# Altium schematic sheet RST_SER_2.SchDoc
size A3
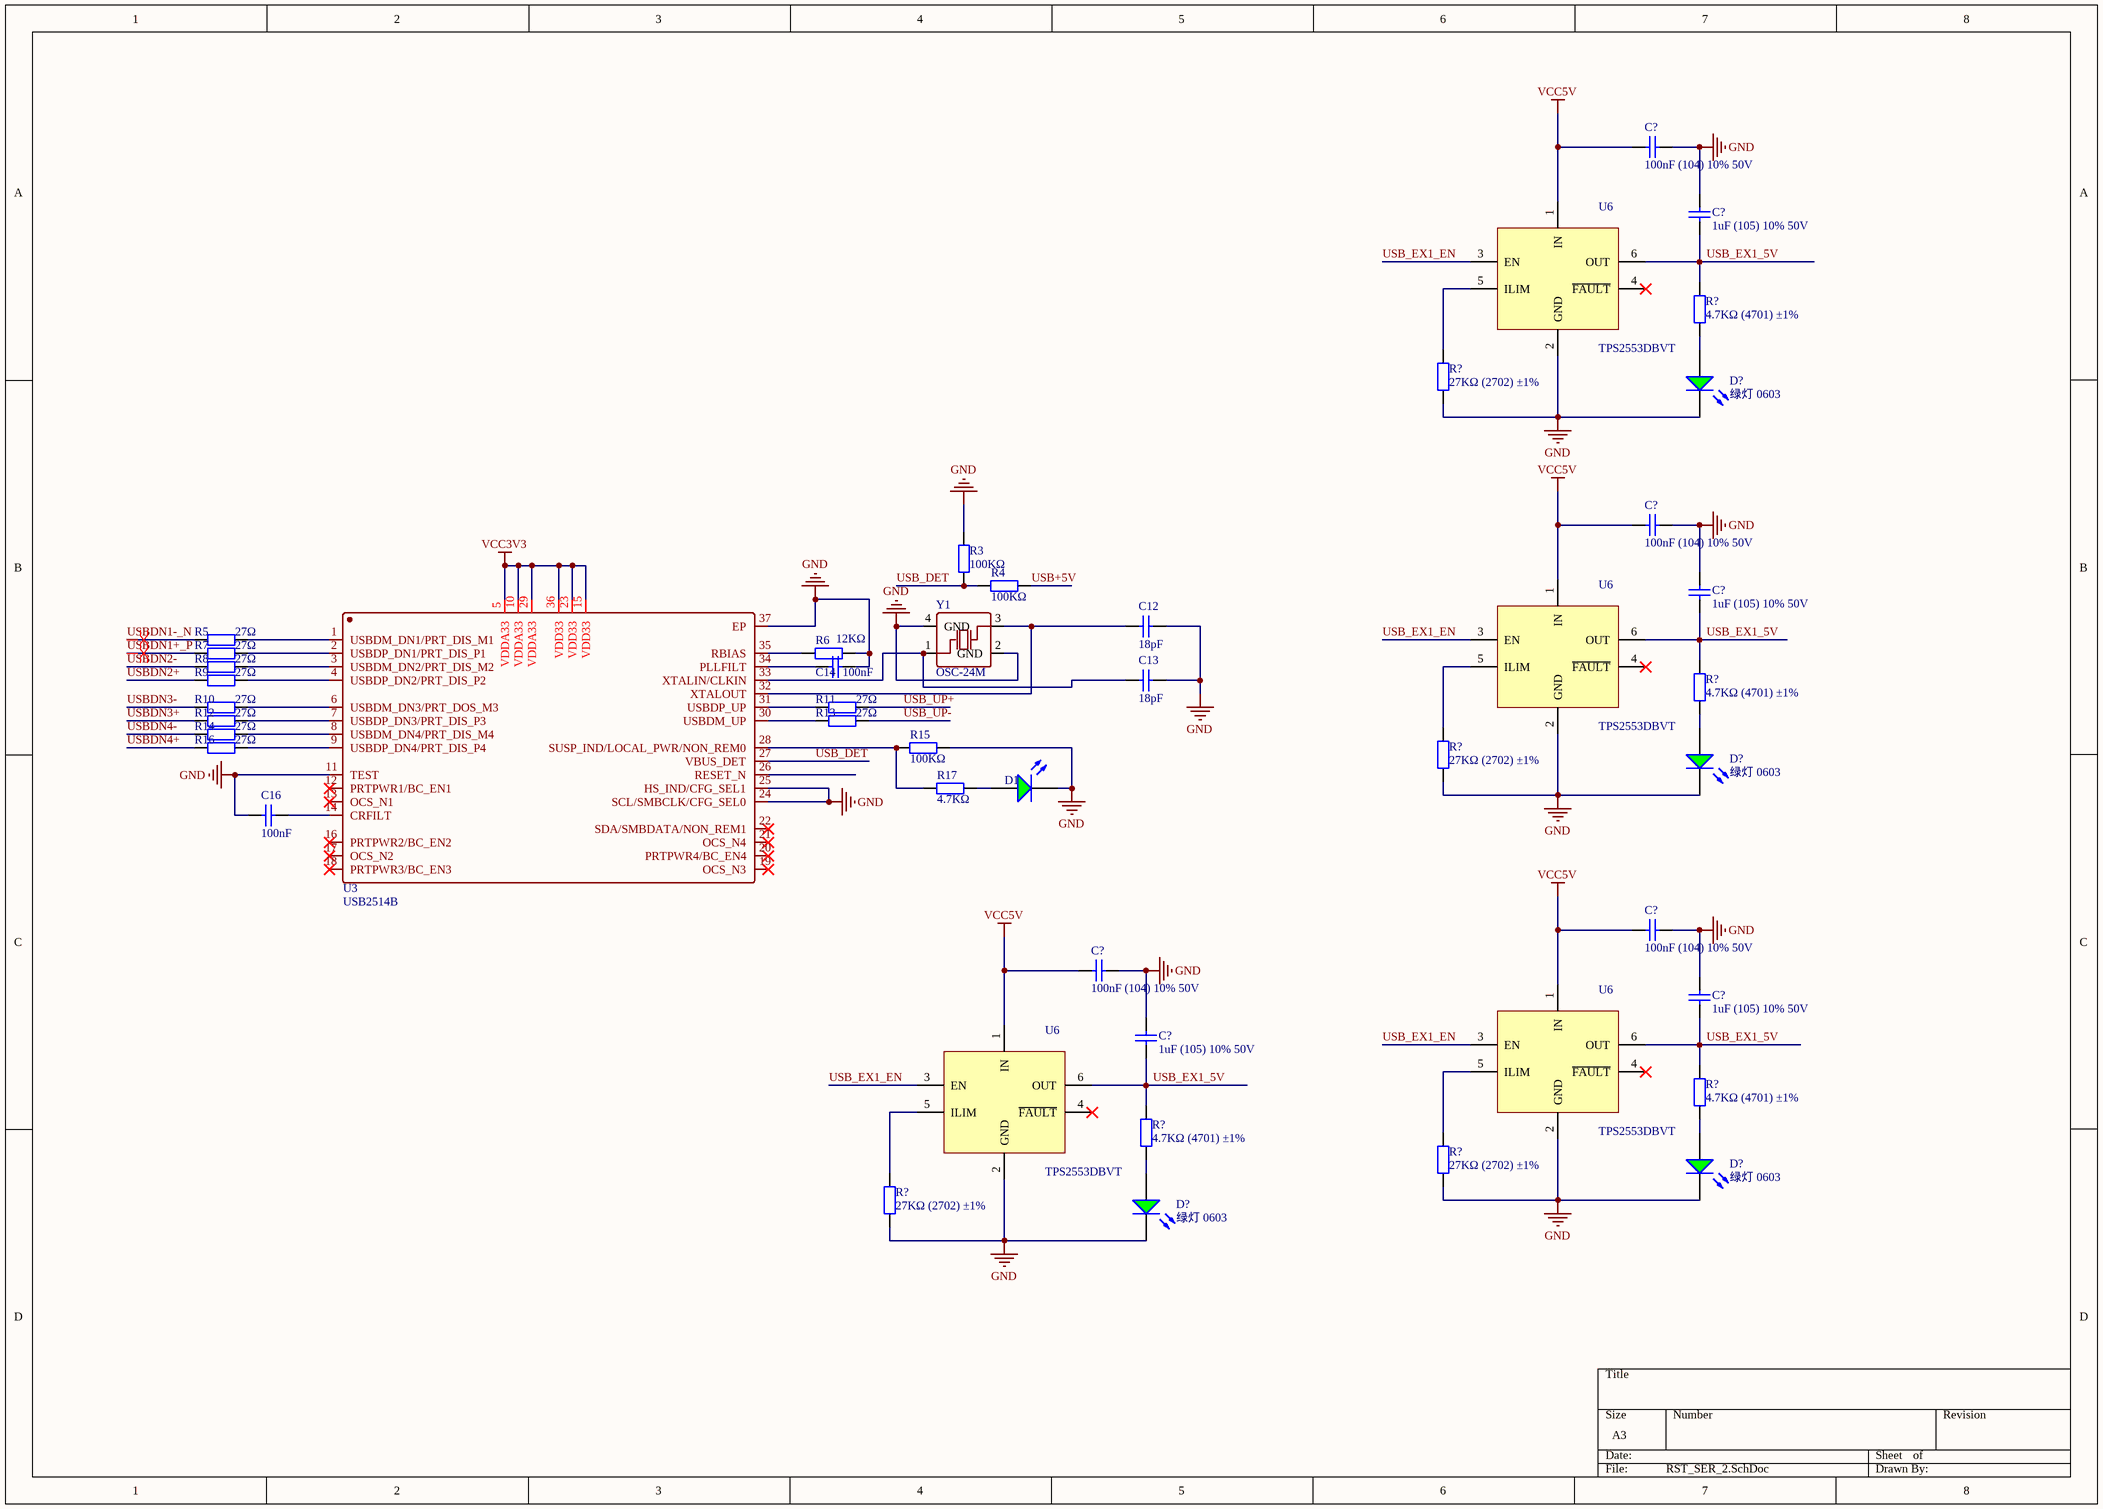
[diagram p0: RST_SER_2.SchDoc]

## Parts
(Parts that share a designator on the sheet are numbered #1, #2 ... from top to bottom, then left to right.)
C12  18pF  [0402_C]
C13  18pF  [0402_C]
C14  100nF  [0402_C]
C16  100nF  [0402_C]
C?#1  100nF (104) 10% 50V  [0603_C]
C?#2  1uF (105) 10% 50V  [0603_C]
C?#3  100nF (104) 10% 50V  [0603_C]
C?#4  1uF (105) 10% 50V  [0603_C]
C?#5  100nF (104) 10% 50V  [0603_C]
C?#6  100nF (104) 10% 50V  [0603_C]
C?#7  1uF (105) 10% 50V  [0603_C]
C?#8  1uF (105) 10% 50V  [0603_C]
D1  绿灯 0603  [0603_LED_S1]  (value not drawn)
D?#1  绿灯 0603  [0603_LED_S1]
D?#2  绿灯 0603  [0603_LED_S1]
D?#3  绿灯 0603  [0603_LED_S1]
D?#4  绿灯 0603  [0603_LED_S1]
R3  100KΩ  [0402_R]
R4  100KΩ  [0402_R]
R5  27Ω  [0402_R]
R6  12KΩ  [0402_R]
R7  27Ω  [0402_R]
R8  27Ω  [0402_R]
R9  27Ω  [0402_R]
R10  27Ω  [0402_R]
R11  27Ω  [0402_R]
R12  27Ω  [0402_R]
R13  27Ω  [0402_R]
R14  27Ω  [0402_R]
R15  100KΩ  [0402_R]
R16  27Ω  [0402_R]
R17  4.7KΩ  [0402_R]
R?#1  4.7KΩ (4701) ±1%  [0603_R]
R?#2  27KΩ (2702) ±1%  [0603_R]
R?#3  4.7KΩ (4701) ±1%  [0603_R]
R?#4  27KΩ (2702) ±1%  [0603_R]
R?#5  4.7KΩ (4701) ±1%  [0603_R]
R?#6  4.7KΩ (4701) ±1%  [0603_R]
R?#7  27KΩ (2702) ±1%  [0603_R]
R?#8  27KΩ (2702) ±1%  [0603_R]
U3  USB2514B
U6#1  TPS2553DBVT  [SOT-23-6]
U6#2  TPS2553DBVT  [SOT-23-6]
U6#3  TPS2553DBVT  [SOT-23-6]
U6#4  TPS2553DBVT  [SOT-23-6]
Y1  OSC-24M

## Nets
GND: C12.2 C13.2 C14.2 C16.1 C?#1.2 C?#2.2 C?#3.2 C?#4.2 C?#5.2 C?#6.2 C?#7.2 C?#8.2 D1.K D?#1.K D?#2.K D?#3.K D?#4.K R3.2 R6.2 R15.2 R?#2.1 R?#4.1 R?#7.1 R?#8.1 U3.11(TEST) U3.24(SCL/SMBCLK/CFG_SEL0) U3.25(HS_IND/CFG_SEL1) U3.37(EP) U6#1.2(GND) U6#2.2(GND) U6#3.2(GND) U6#4.2(GND) Y1.2(GND) Y1.4(GND)
VCC3V3: U3.5(VDDA33) U3.10(VDDA33) U3.15(VDD33) U3.23(VDD33) U3.29(VDDA33) U3.36(VDD33)
VCC5V: C?#1.1 C?#3.1 C?#5.1 C?#6.1 U6#1.1(IN) U6#2.1(IN) U6#3.1(IN) U6#4.1(IN)
USB+5V: R4.2
USB_DET: R3.1 R4.1 U3.27(VBUS_DET)
USB_EX1_5V: C?#2.1 C?#4.1 C?#7.1 C?#8.1 R?#1.2 R?#3.2 R?#5.2 R?#6.2 U6#1.6(OUT) U6#2.6(OUT) U6#3.6(OUT) U6#4.6(OUT)
USB_EX1_EN: U6#1.3(EN) U6#2.3(EN) U6#3.3(EN) U6#4.3(EN)
USB_UP+: R11.2
USB_UP-: R13.2
USBDN1+_P: R7.1
USBDN1-_N: R5.1
USBDN2+: R9.1
USBDN2-: R8.1
USBDN3+: R12.1
USBDN3-: R10.1
USBDN4+: R16.1
USBDN4-: R14.1
NetC12_1: C12.1 U3.32(XTALOUT) Y1.3(OSC2)
NetC13_1: C13.1 U3.33(XTALIN/CLKIN) Y1.1(OSC1)
NetC14_1: C14.1 U3.34(PLLFILT)
NetC16_2: C16.2 U3.14(CRFILT)
NetD1_A: D1.A R17.2
NetD?#1_A: D?#1.A R?#1.1
NetD?#2_A: D?#2.A R?#3.1
NetD?#3_A: D?#3.A R?#5.1
NetD?#4_A: D?#4.A R?#6.1
NetR5_2: R5.2 U3.1(USBDM_DN1/PRT_DIS_M1)
NetR6_1: R6.1 U3.35(RBIAS)
NetR7_2: R7.2 U3.2(USBDP_DN1/PRT_DIS_P1)
NetR8_2: R8.2 U3.3(USBDM_DN2/PRT_DIS_M2)
NetR9_2: R9.2 U3.4(USBDP_DN2/PRT_DIS_P2)
NetR10_2: R10.2 U3.6(USBDM_DN3/PRT_DOS_M3)
NetR11_1: R11.1 U3.31(USBDP_UP)
NetR12_2: R12.2 U3.7(USBDP_DN3/PRT_DIS_P3)
NetR13_1: R13.1 U3.30(USBDM_UP)
NetR14_2: R14.2 U3.8(USBDM_DN4/PRT_DIS_M4)
NetR15_1: R15.1 R17.1 U3.28(SUSP_IND/LOCAL_PWR/NON_REM0)
NetR16_2: R16.2 U3.9(USBDP_DN4/PRT_DIS_P4)
NetR?#2_2: R?#2.2 U6#1.5(ILIM)
NetR?#4_2: R?#4.2 U6#2.5(ILIM)
NetR?#7_2: R?#7.2 U6#3.5(ILIM)
NetR?#8_2: R?#8.2 U6#4.5(ILIM)

Not connected (* = marked no-connect by the designer): U3 12(PRTPWR1/BC_EN1)* 13(OCS_N1)* 16(PRTPWR2/BC_EN2)* 17(OCS_N2)* 18(PRTPWR3/BC_EN3)* 19(OCS_N3)* 20(PRTPWR4/BC_EN4)* 21(OCS_N4)* 22(SDA/SMBDATA/NON_REM1)* 26(RESET_N); U6#1 4(~{FAULT})*; U6#2 4(~{FAULT})*; U6#3 4(~{FAULT})*; U6#4 4(~{FAULT})*

## Layout directives
differential pair: USBDN1+_P, USBDN1-_N

## Library data of the parts
C12 C13 = 0402 18pF (180) 5% 50V: 贴片电容; ComponentLink1Description: 供应商链接; ComponentLink1URL: http://www.szlcsc.com/product/details_1901.html; Package: 0402; Supplier: LC; SuppliersPartNumber: C1549
C14 C16 = 0402 100nF (104) 10% 16V: 贴片电容; ComponentLink1Description: 供应商链接; ComponentLink1URL: http://www.szlcsc.com/product/details_1877.html; Package: 0402; Supplier: LC; SuppliersPartNumber: C1525
C?#1 C?#3 C?#5 C?#6 = 0603 100nF (104) 10% 50V: 贴片电容; ComponentLink1Description: 供应商链接; ComponentLink1URL: http://www.szlcsc.com/product/details_15331.html; Package: 0603; Supplier: LC; SuppliersPartNumber: C14663
C?#2 C?#4 C?#7 C?#8 = 0603 1uF (105) 10% 50V: 贴片电容; ComponentLink1Description: 供应商链接; ComponentLink1URL: http://www.szlcsc.com/product/details_16531.html; Package: 0603; Supplier: LC; SuppliersPartNumber: C15849
D1 D?#1-D?#4 = 0603 绿灯: 发光二极管; ComponentLink1Description: 供应商链接; ComponentLink1URL: http://www.szlcsc.com/product/details_73152.html; Package: 0603; Supplier: LC; SuppliersPartNumber: C72043
R3 R4 R15 = 0402 100KΩ (1003) 1%: 贴片电阻; ComponentLink1Description: 供应商链接; ComponentLink1URL: http://www.szlcsc.com/product/details_26484.html; Package: 0402; Supplier: LC; SuppliersPartNumber: C25741
R5 R7-R14 R16 = 0402 27KΩ (2702) 1%: 贴片电阻; ComponentLink1Description: 供应商链接; ComponentLink1URL: http://www.szlcsc.com/product/details_26514.html; Package: 0402; Supplier: LC; SuppliersPartNumber: C25771
R6 = 0402 12KΩ (1202) 1%: 贴片电阻; ComponentLink1Description: 供应商链接; ComponentLink1URL: http://www.szlcsc.com/product/details_26495.html; Package: 0402; Supplier: LC; SuppliersPartNumber: C25752
R17 = 0402 4.7KΩ (4701) 1%: 贴片电阻; ComponentLink1Description: 供应商链接; ComponentLink1URL: http://www.szlcsc.com/product/details_26643.html; Package: 0402; Supplier: LC; SuppliersPartNumber: C25900
R?#1 R?#3 R?#5 R?#6 = 0603 4.7KΩ (4701) 1%: 贴片电阻; ComponentLink1Description: 供应商链接; ComponentLink1URL: http://www.szlcsc.com/product/details_23889.html; Package: 0603; Supplier: LC; SuppliersPartNumber: C23162
R?#2 R?#4 R?#7 R?#8 = 0603 27KΩ (2702) 1%: 贴片电阻; ComponentLink1Description: 供应商链接; ComponentLink1URL: http://www.szlcsc.com/product/details_23694.html; Package: 0603; Supplier: LC; SuppliersPartNumber: C22967
U6#1-U6#4 = TPS2553DBVT: SOT-23-6
Y1 = OSC-24M: SMD-3225_4P